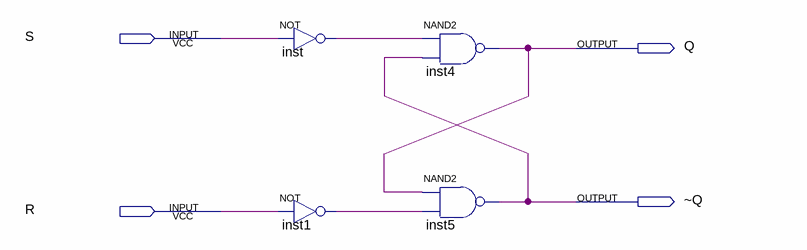
[diagram p0: schematic sheet]
// Quartus schematic lab09step1.bdf as structural Verilog: 4 symbols, 4 pins
module lab09step1 (
  input  S,
  input  R,
  output Q,
  output \~Q 
);

  wire inst1_out, inst_out;

  not inst (inst_out, S);
  not inst1 (inst1_out, R);
  nand inst4 (Q, inst_out, \~Q );
  nand inst5 (\~Q , Q, inst1_out);
endmodule
